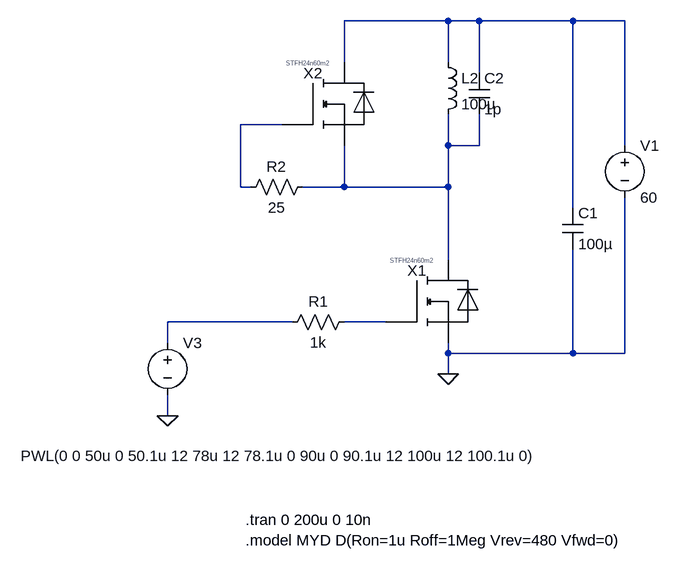
[diagram p0: schematic STFH24N60M2_test_bodyDiode.asc]
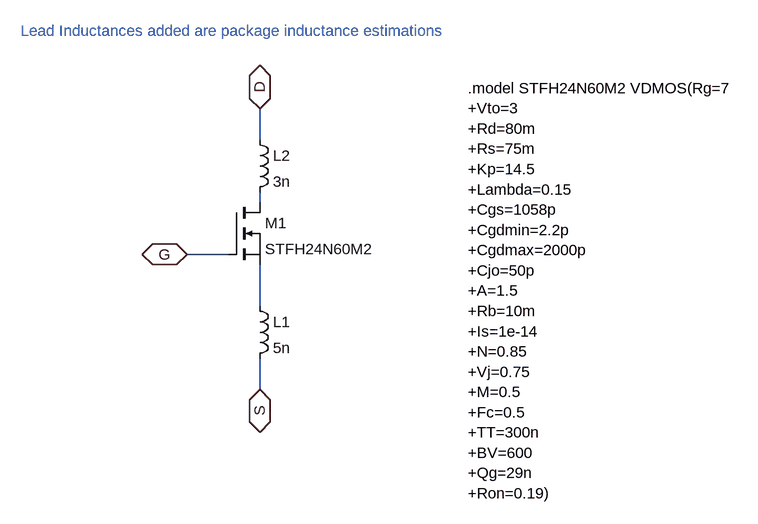
[diagram p1: sub-circuit stfh24n60m2.asc]
STFH24N60M2_test_bodyDiode.asc, the LTspice schematic file:
Version 4.1
SHEET 1 1124 1028
WIRE 352 -176 192 -176
WIRE 400 -176 352 -176
WIRE 544 -176 400 -176
WIRE 624 -176 544 -176
WIRE 192 -112 192 -176
WIRE 352 -112 352 -176
WIRE 400 -96 400 -176
WIRE 96 -16 32 -16
WIRE 352 16 352 -32
WIRE 400 16 400 -32
WIRE 400 16 352 16
WIRE 624 16 624 -176
WIRE 32 80 32 -16
WIRE 48 80 32 80
WIRE 192 80 192 16
WIRE 192 80 128 80
WIRE 352 80 352 16
WIRE 352 80 192 80
WIRE 544 112 544 -176
WIRE 352 192 352 80
WIRE 112 288 -80 288
WIRE 256 288 192 288
WIRE -80 320 -80 288
WIRE 352 336 352 320
WIRE 544 336 544 176
WIRE 544 336 352 336
WIRE 624 336 624 96
WIRE 624 336 544 336
WIRE 352 368 352 336
WIRE -80 432 -80 400
FLAG 352 368 0
FLAG -80 432 0
SYMBOL STFH24N60M2 432 256 R0
SYMATTR InstName X1
SYMBOL ind 336 -128 R0
SYMATTR InstName L2
SYMATTR Value 100µ
SYMBOL res 208 272 R90
WINDOW 0 0 56 VBottom 2
WINDOW 3 32 56 VTop 2
SYMATTR InstName R1
SYMATTR Value 1k
SYMBOL cap 528 112 R0
SYMATTR InstName C1
SYMATTR Value 100µ
SYMBOL STFH24N60M2 272 -48 R0
SYMATTR InstName X2
SYMBOL voltage 624 0 R0
WINDOW 123 0 0 Left 0
WINDOW 39 0 0 Left 0
SYMATTR InstName V1
SYMATTR Value 60
SYMBOL cap 384 -96 R0
SYMATTR InstName C2
SYMATTR Value 1p
SYMBOL voltage -80 304 R0
WINDOW 3 -226 190 Left 2
WINDOW 123 0 0 Left 0
WINDOW 39 0 0 Left 0
SYMATTR InstName V3
SYMATTR Value PWL(0 0 50u 0 50.1u 12 78u 12 78.1u 0 90u 0 90.1u 12 100u 12 100.1u 0)
SYMBOL res 144 64 R90
WINDOW 0 0 56 VBottom 2
WINDOW 3 32 56 VTop 2
SYMATTR InstName R2
SYMATTR Value 25
TEXT 40 624 Left 2 !.model MYD D(Ron=1u Roff=1Meg Vrev=480 Vfwd=0)
TEXT 40 592 Left 2 !.tran 0 200u 0 10n

stfh24n60m2.asc, the sub-circuit schematic file:
Version 4.1
SHEET 1 2968 980
WIRE -256 -144 -256 -192
WIRE -256 -48 -256 -64
WIRE -304 32 -368 32
WIRE -256 112 -256 48
WIRE -256 240 -256 192
FLAG -256 -192 D
IOPIN -256 -192 BiDir
FLAG -368 32 G
IOPIN -368 32 BiDir
FLAG -256 240 S
IOPIN -256 240 BiDir
SYMBOL nmos -304 -48 R0
SYMATTR InstName M1
SYMATTR Value STFH24N60M2
SYMBOL ind -272 96 R0
SYMATTR InstName L1
SYMATTR Value 5n
SYMATTR SpiceLine Cpar=10p
SYMBOL ind -272 -160 R0
SYMATTR InstName L2
SYMATTR Value 3n
SYMATTR SpiceLine Cpar=10p
TEXT -624 -312 Left 2 ;Lead Inductances added are package inductance estimations
TEXT 64 -224 Left 2 !.model STFH24N60M2 VDMOS(Rg=7 \n+Vto=3\n+Rd=80m\n+Rs=75m\n+Kp=14.5\n+Lambda=0.15\n+Cgs=1058p\n+Cgdmin=2.2p\n+Cgdmax=2000p\n+Cjo=50p\n+A=1.5\n+Rb=10m\n+Is=1e-14\n+N=0.85\n+Vj=0.75\n+M=0.5\n+Fc=0.5\n+TT=300n\n+BV=600\n+Qg=29n\n+Ron=0.19)

The netlist it stands for:
* STFH24N60M2_test_bodyDiode.asc
X§X1 N003 N005 0 stfh24n60m2
L2 N001 N003 100µ
R1 N005 N004 1k
C1 N001 0 100µ
X§X2 N001 N002 N003 stfh24n60m2
V1 N001 0 60
C2 N001 N003 1p
V3 N004 0 PWL(0 0 50u 0 50.1u 12 78u 12 78.1u 0 90u 0 90.1u 12 100u 12 100.1u 0)
R2 N003 N002 25

* block symbol definitions
.subckt stfh24n60m2 D G S
M1 N001 G N002 N002 STFH24N60M2
L1 N002 S 5n Cpar=10p
L2 D N001 3n Cpar=10p
* Lead Inductances added are package inductance estimations
.model STFH24N60M2 VDMOS(Rg=7
+Vto=3
+Rd=80m
+Rs=75m
+Kp=14.5
+Lambda=0.15
+Cgs=1058p
+Cgdmin=2.2p
+Cgdmax=2000p
+Cjo=50p
+A=1.5
+Rb=10m
+Is=1e-14
+N=0.85
+Vj=0.75
+M=0.5
+Fc=0.5
+TT=300n
+BV=600
+Qg=29n
+Ron=0.19)
.ends stfh24n60m2

.model NMOS NMOS
.model PMOS PMOS
.lib standard.mos
.model MYD D(Ron=1u Roff=1Meg Vrev=480 Vfwd=0)
.tran 0 200u 0 10n
.backanno
.end